# Altium schematic sheet RADM-RadioModule-S01-V00.SchDoc: RADM Radio Module (Digi SX 915Mhz Radio)
size A3; DrawnBy: Jonn Dillon; DocumentNumber: 2; SheetNumber: 2; SheetTotal: 6; Version: 00; Project: QUTMS RADIO M2M; PageSetup: Record=PageOptions|CenterHorizontal=True|CenterVertical=True|PrintScale=0.97|XCorrection=1.00|YCorrection=1.00|PrintKind=0|BorderSize=5000000|LeftOffset=0|BottomOffset=0|Orientation=2|PaperLength=1000|PaperWidth=1000|Scale=100|PaperSource=7|PrintQuality=-4|MediaType=1|DitherType=10|PaperKind=A4|PrintScaleMode=1
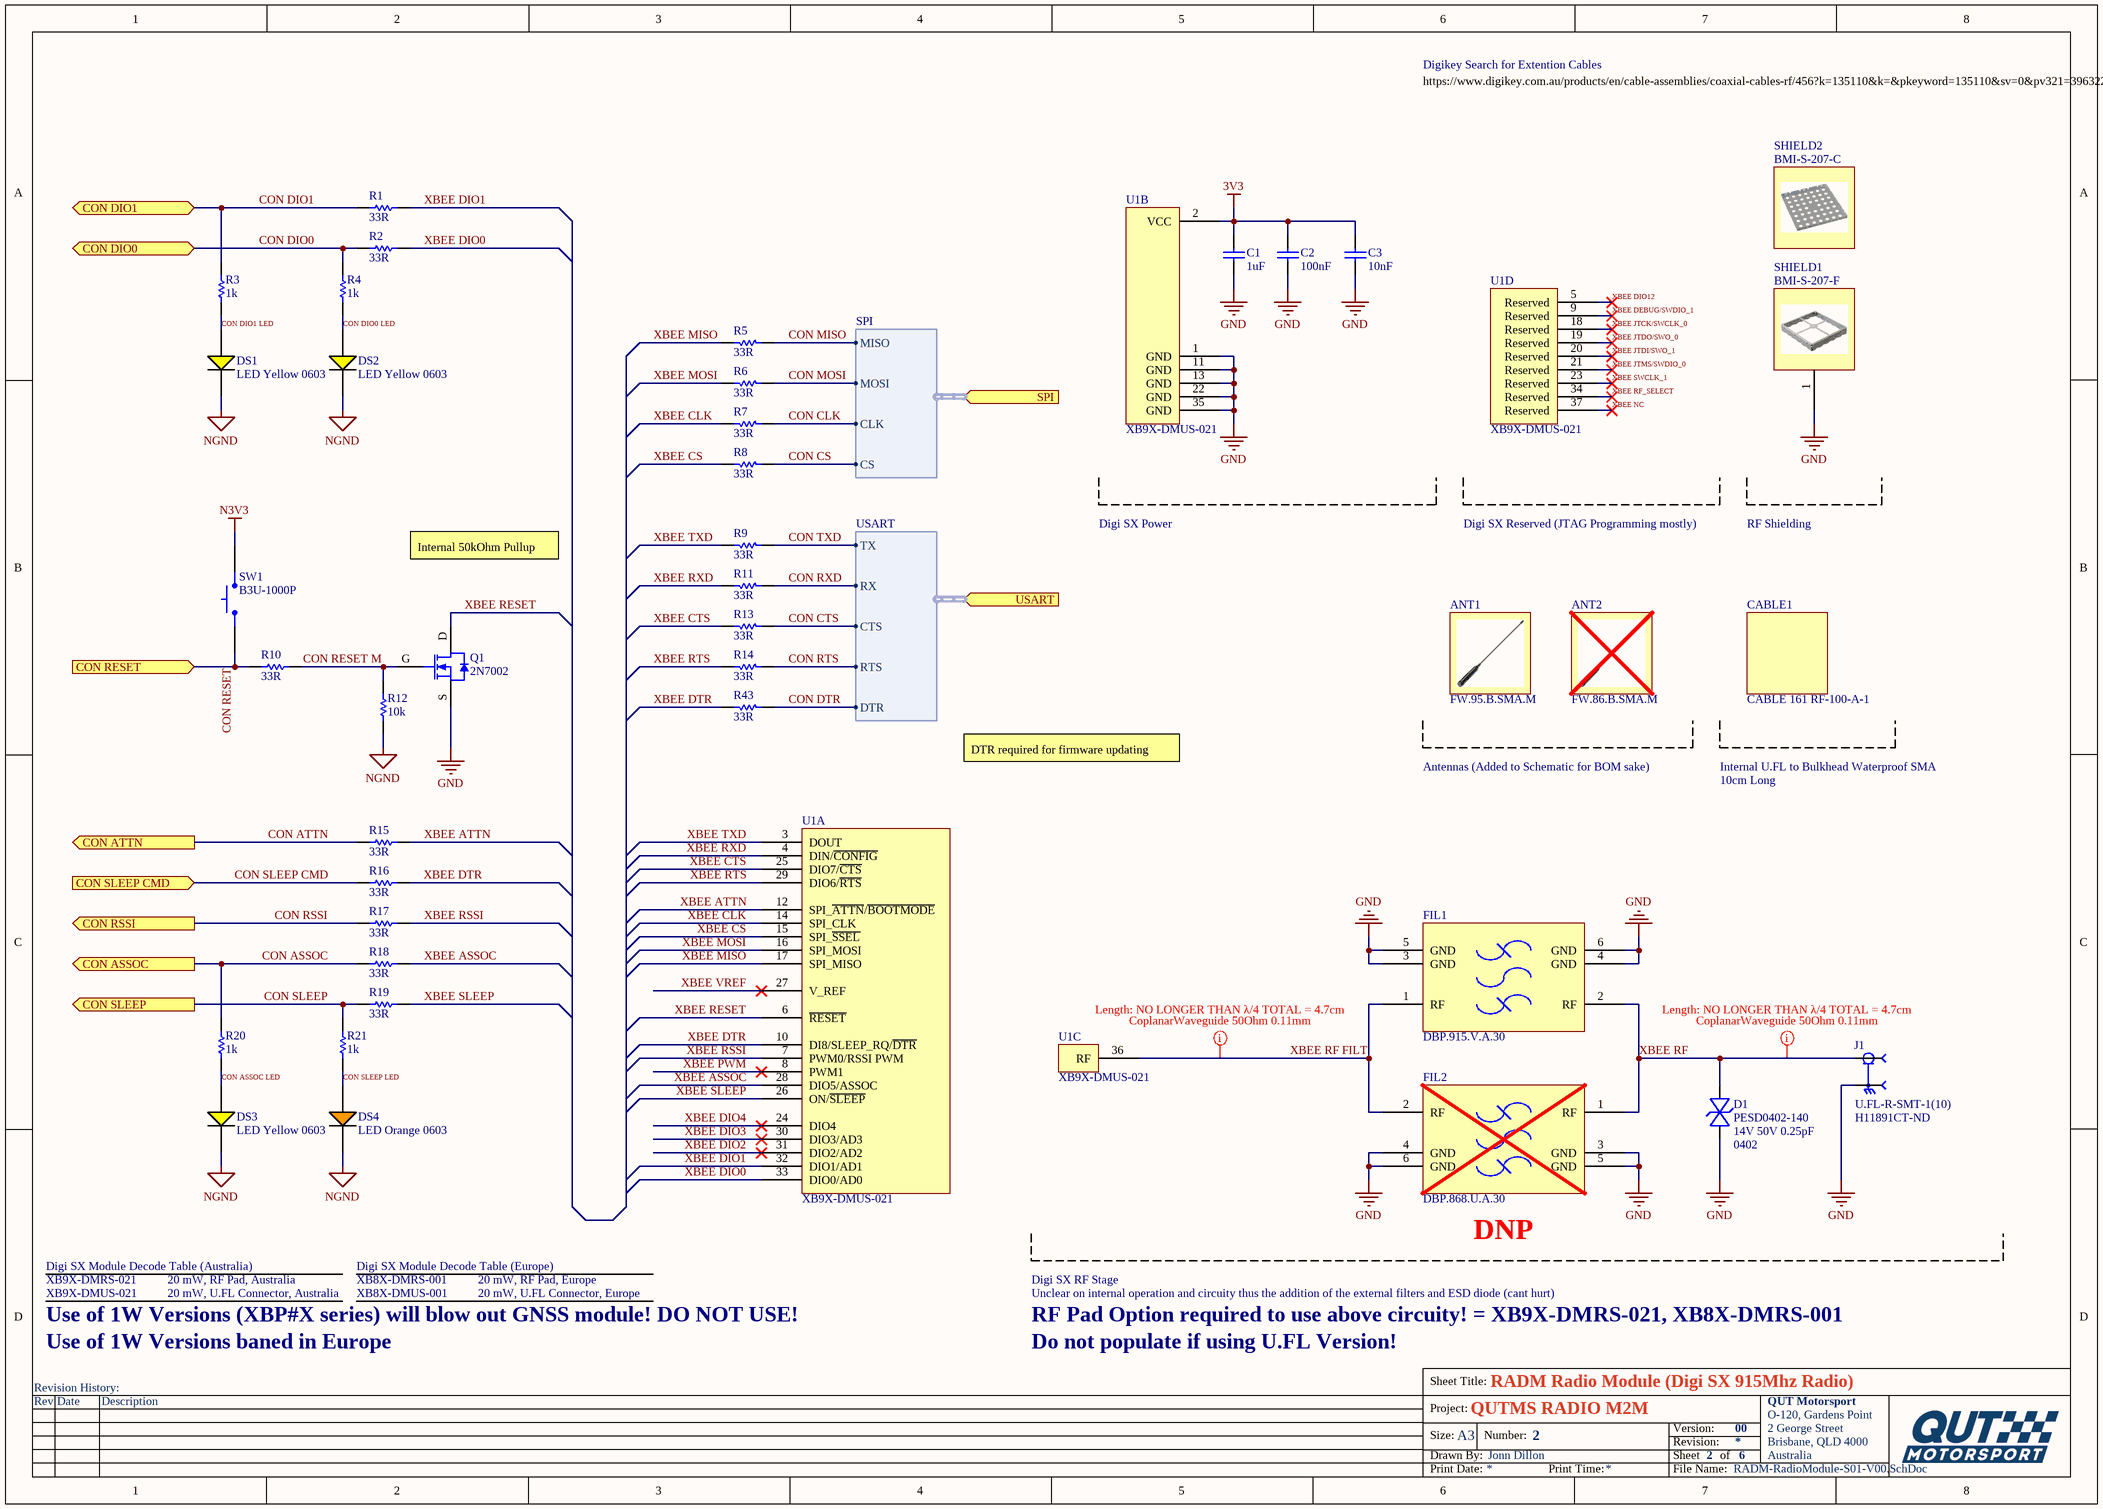
[diagram p0: RADM-RadioModule-S01-V00.SchDoc]

## Parts
ANT1  FW.95.B.SMA.M
ANT2  FW.86.B.SMA.M  (graphical)
C1  1uF  [Cap_Ceramic_0603]
C2  100nF  [Cap_Ceramic_0603]
C3  10nF  [Cap_Ceramic_0603]
CABLE1  CABLE 161 RF-100-A-1
D1  PESD0402-140  [FERRITEBEAD_0402]
DS1  LED Yellow 0603  [LED YELLOW 0603]
DS2  LED Yellow 0603  [LED YELLOW 0603]
DS3  LED Yellow 0603  [LED YELLOW 0603]
DS4  LED Orange 0603  [LED ORANGE 0603]
FIL1  DBP.915.V.A.30  [TAOGLAS 915MHZ FILTER]
FIL2  DBP.868.U.A.30  [TAOGLAS 868MHZ FILTER]  (net tie, no BOM)
J1  U.FL-R-SMT-1(10)  [U.FL-R-SMT HIROSE]
Q1  2N7002  [SOT23-3]
R1  33R  [Res_ThinFilm_0603]
R2  33R  [Res_ThinFilm_0603]
R3  1k  [Res_ThinFilm_0603]
R4  1k  [Res_ThinFilm_0603]
R5  33R  [Res_ThinFilm_0603]
R6  33R  [Res_ThinFilm_0603]
R7  33R  [Res_ThinFilm_0603]
R8  33R  [Res_ThinFilm_0603]
R9  33R  [Res_ThinFilm_0603]
R10  33R  [Res_ThinFilm_0603]
R11  33R  [Res_ThinFilm_0603]
R12  10k  [Res_ThinFilm_0603]
R13  33R  [Res_ThinFilm_0603]
R14  33R  [Res_ThinFilm_0603]
R15  33R  [Res_ThinFilm_0603]
R16  33R  [Res_ThinFilm_0603]
R17  33R  [Res_ThinFilm_0603]
R18  33R  [Res_ThinFilm_0603]
R19  33R  [Res_ThinFilm_0603]
R20  1k  [Res_ThinFilm_0603]
R21  1k  [Res_ThinFilm_0603]
R43  33R  [Res_ThinFilm_0603]
SHIELD1  BMI-S-207-F  [BMI-S-207-F]
SHIELD2  BMI-S-207-C
SW1  B3U-1000P  [BTN B3U-1000P]
U1  XB9X-DMUS-021  [XBee_1W_Base]  (parts A,B,C,D of 4)

## Ports
CON ASSOC (out), CON ATTN (out), CON DIO0 (bidir), CON DIO1 (bidir), CON RESET (in), CON RSSI (out), CON SLEEP (out), CON SLEEP CMD (in), SPI (in, harness SPI), USART (in, harness USART)

## Harnesses
USART: TX, RX, RTS, CTS, DTR
SPI: MISO, MOSI, CLK, CS

## Nets
3V3: C1.2 C2.2 C3.2 U1.2(VCC)
GND: C1.1 C2.1 C3.1 D1.1(Anode) FIL1.3(GND) FIL1.4(GND) FIL1.5(GND) FIL1.6(GND) FIL2.3(GND) FIL2.4(GND) FIL2.5(GND) FIL2.6(GND) J1.2(GND) Q1.S SHIELD1.1 U1.1(GND) U1.11(GND) U1.13(GND) U1.22(GND) U1.35(GND)
N3V3: SW1.2
NGND: DS1.2(C) DS2.2(C) DS3.2(C) DS4.2(C) R12.1
CON ASSOC: R18.1 R20.2 ; port CON ASSOC
CON ASSOC LED: DS3.1(A) R20.1
CON ATTN: R15.1 ; port CON ATTN
CON CLK: R7.1 ; port SPI.CLK
CON CS: R8.1 ; port SPI.CS
CON CTS: R13.1 ; port USART.CTS
CON DIO0: R2.1 R4.2 ; port CON DIO0
CON DIO0 LED: DS2.1(A) R4.1
CON DIO1: R1.1 R3.2 ; port CON DIO1
CON DIO1 LED: DS1.1(A) R3.1
CON DTR: R43.1 ; port USART.DTR
CON MISO: R5.1 ; port SPI.MISO
CON MOSI: R6.1 ; port SPI.MOSI
CON RESET: R10.1 SW1.1 ; port CON RESET
CON RESET M: Q1.G R10.2 R12.2
CON RSSI: R17.1 ; port CON RSSI
CON RTS: R14.1 ; port USART.RTS
CON RXD: R11.1 ; port USART.RX
CON SLEEP: R19.1 R21.2 ; port CON SLEEP
CON SLEEP CMD: R16.1 ; port CON SLEEP CMD
CON SLEEP LED: DS4.1(A) R21.1
CON TXD: R9.1 ; port USART.TX
XBEE ASSOC: R18.2 U1.28(DIO5/ASSOC)
XBEE ATTN: R15.2 U1.12(SPI_~{ATTN}/~{BOOTMODE})
XBEE CLK: R7.2 U1.14(SPI_CLK)
XBEE CS: R8.2 U1.15(SPI_~{SSEL})
XBEE CTS: R13.2 U1.25(DIO7/~{CTS})
XBEE DEBUG/SWDIO_1: U1.9(Reserved)
XBEE DIO0: R2.2 U1.33(DIO0/AD0)
XBEE DIO1: R1.2 U1.32(DIO1/AD1)
XBEE DIO2: U1.31(DIO2/AD2)
XBEE DIO3: U1.30(DIO3/AD3)
XBEE DIO4: U1.24(DIO4)
XBEE DIO12: U1.5(Reserved)
XBEE DTR: R16.2 R43.2 U1.10(DI8/SLEEP_RQ/~{DTR})
XBEE JTCK/SWCLK_0: U1.18(Reserved)
XBEE JTDI/SWO_1: U1.20(Reserved)
XBEE JTDO/SWO_0: U1.19(Reserved)
XBEE JTMS/SWDIO_0: U1.21(Reserved)
XBEE MISO: R5.2 U1.17(SPI_MISO)
XBEE MOSI: R6.2 U1.16(SPI_MOSI)
XBEE NC: U1.37(Reserved)
XBEE PWM: U1.8(PWM1)
XBEE RESET: Q1.D U1.6(~{RESET})
XBEE RF: D1.2(Cathode) FIL1.2(RF) FIL2.1(RF) J1.1(SIG)
XBEE RF FILT: FIL1.1(RF) FIL2.2(RF) U1.36(RF)
XBEE RF_SELECT: U1.34(Reserved)
XBEE RSSI: R17.2 U1.7(PWM0/RSSI_PWM)
XBEE RTS: R14.2 U1.29(DIO6/~{RTS})
XBEE RXD: R11.2 U1.4(DIN/~{CONFIG})
XBEE SLEEP: R19.2 U1.26(ON/~{SLEEP})
XBEE SWCLK_1: U1.23(Reserved)
XBEE TXD: R9.2 U1.3(DOUT)
XBEE VREF: U1.27(V_REF)

## Layout directives
rule Width Constraint [Pref Width = 9mil    Min Width = 9mil    Max Width = 9mil]; rule Impedance Constraint [Min = 49.50    Max = 50.50    ]; rule Clearance Constraint [Clearance = 14.5mil]: XBEE RF, XBEE RF FILT

## Notes on the sheet
- Digikey Search for Extention Cables
- https://www.digikey.com.au/products/en/cable-assemblies/coaxial-cables-rf/456?k=135110&k=&pkeyword=135110&sv=0&pv321=396322&pv321=396362&pv321=396527&pv321=396529&pv2157=u3GHz&pv2157=u12.4GHz&sf=0&FV=-8%7C456&quantity=&ColumnSort=1000011&page=1&stock=1&nstock=1&datasheet=1&pageSize=25
- Internal 50kOhm Pullup
- Digi SX Power
- Digi SX Reserved (JTAG Programming mostly)
- RF Shielding
- DTR required for firmware updating
- Antennas (Added to Schematic for BOM sake)
- Internal U.FL to Bulkhead Waterproof SMA
- 10cm Long
- (near U1) Length: NO LONGER THAN λ/4 TOTAL = 4.7cm
- (near J1) Length: NO LONGER THAN λ/4 TOTAL = 4.7cm
- (near J1) H11891CT-ND
- (near D1) 14V 50V 0.25pF
- (near D1) 0402
- (near FIL2) DNP
- Digi SX Module Decode Table (Australia)
- XB9X-DMRS-021
- XB9X-DMUS-021
- Use of 1W Versions (XBP#X series) will blow out GNSS module! DO NOT USE!
- 20 mW, RF Pad, Australia
- 20 mW, U.FL Connector, Australia
- Digi SX Module Decode Table (Europe)
- XB8X-DMRS-001
- XB8X-DMUS-001
- 20 mW, RF Pad, Europe
- 20 mW, U.FL Connector, Europe
- Digi SX RF Stage
- Unclear on internal operation and circuity thus the addition of the external filters and ESD diode (cant hurt)
- RF Pad Option required to use above circuity! = XB9X-DMRS-021, XB8X-DMRS-001
- Use of 1W Versions baned in Europe
- Do not populate if using U.FL Version!
- Revision History:
- Sheet Title:
- Rev
- Date
- Description
- Project:
- Size:
- Drawn By:
- A3
- Number:
- Revision:
- Sheet
- Version:
- of
- QUT Motorsport
- O-120, Gardens Point
- 2 George Street
- Brisbane, QLD 4000
- Australia
- Print Date:
- Print Time:
- File Name:

## Library data of the parts
ANT1 = FW.95.B.SMA.M: 915MHz ISM Whip, Straight RF Antenna 2.7dBi SMA Male Connector Mount
ANT2 = FW.86.B.SMA.M: 868MHz ISM Whip, Straight RF Antenna 2.8dBi SMA Male Connector Mount
C1 = 1uF 25V 5% X7R 0603: Capacitor, Ceramic, SMD, 1uF, 25V, 5%, X7R, 0603
C2 = 100nF 50V 5% X7R 0603: Capacitor, Ceramic, SMD, 100nF, 50V, 5%, X7R, 0603
C3 = 10nF 50V 5% X7R 0603: Capacitor, Ceramic, SMD, 10nF, 50V, 5%, X7R, 0603
CABLE1 = CABLE 161 RF-100-A-1: Cable Assembly Coaxial U.FL (UMCC), IPEX MHF1 to SMA Female to Female RG-178 3.937" (100.00mm)
D1 = PESD0402-140: 40V Clamp Ipp Tvs Diode Surface Mount 0402
FIL1 = DBP.915.V.A.30: 915MHz Frequency Band Pass RF Filter (Radio Frequency) 5MHz Bandwidth 3.2dB 2-SMD, No Lead
FIL2 = DBP.868.U.A.30: 868MHz Frequency Band Pass RF Filter (Radio Frequency) 4MHz Bandwidth 3dB 2-SMD, No Lead
J1 = U.FL-R-SMT-1(10): U.FL (UMCC) Connector Receptacle, Male Pin 50Ohm Surface Mount Solder,  H11891CT-ND
R1 R2 R5-R11 R13-R19 R43 = 33R 5% 0603: Resistor, SMD, 33R, 0.1W, 5%, 0603
R3 R4 R20 R21 = 1k 5% 0603: Resistor, SMD, 1k, 0.1W, 5%, 0603
R12 = 10k 5% 0603: Resistor, SMD, 10k, 0.1W, 5%, 0603
SHIELD1 = BMI-S-207-F: RF Shield Frame 1.747" (44.37mm) X 1.747" (44.37mm) Solder
SHIELD2 = BMI-S-207-C: RF Shield Cover 1.344" (34.14mm) X 1.468" (37.29mm) Vent Holes in Pattern Snap Fit
SW1 = BTN B3U-1000P: Omron B3U-1000P Ultra Miniture Switch; ComponentLink1Description: LCSC; ComponentLink1URL: https://lcsc.com/product-detail/Tactile-Switches_BRIGHT-TSA063G50-250_C294565.html
U1 = XB9X-DMUS-021: General ISM < 1GHz Transceiver Module 902MHz ~ 928MHz Antenna Not Included, U.FL Surface Mount